# Altium schematic sheet EmbeddedDebugger.SchDoc
size A3
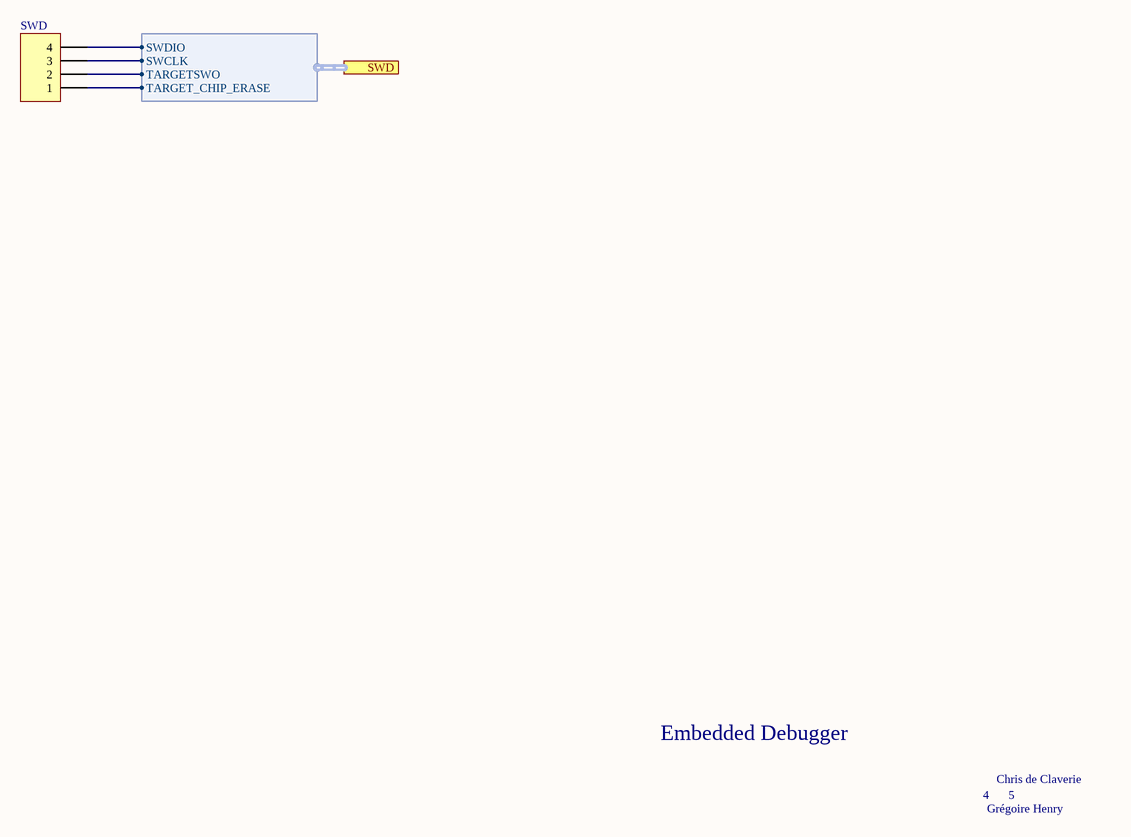
[diagram p0: EmbeddedDebugger.SchDoc]

## Parts
SWD  Header 4  [HDR1X4]  (value not drawn)

## Ports
SWD (harness *)

## Harnesses
*: TARGET_CHIP_ERASE, TARGETSWO, SWCLK, SWDIO

## Nets
NetSWD_1: SWD.1 ; port SWD.TARGET_CHIP_ERASE
NetSWD_2: SWD.2 ; port SWD.TARGETSWO
NetSWD_3: SWD.3 ; port SWD.SWCLK
NetSWD_4: SWD.4 ; port SWD.SWDIO

## Notes on the sheet
- Embedded Debugger
- 4
- Chris de Claverie
- 5
- Grégoire Henry

## Library data of the parts
SWD = Header 4: Header, 4-Pin; LatestRevisionDate: 17-Jul-2002; LatestRevisionNote: Re-released for DXP Platform.; Publisher: Altium Limited